# Altium project MINT_EEGAcquisitionSystem.PrjPcb
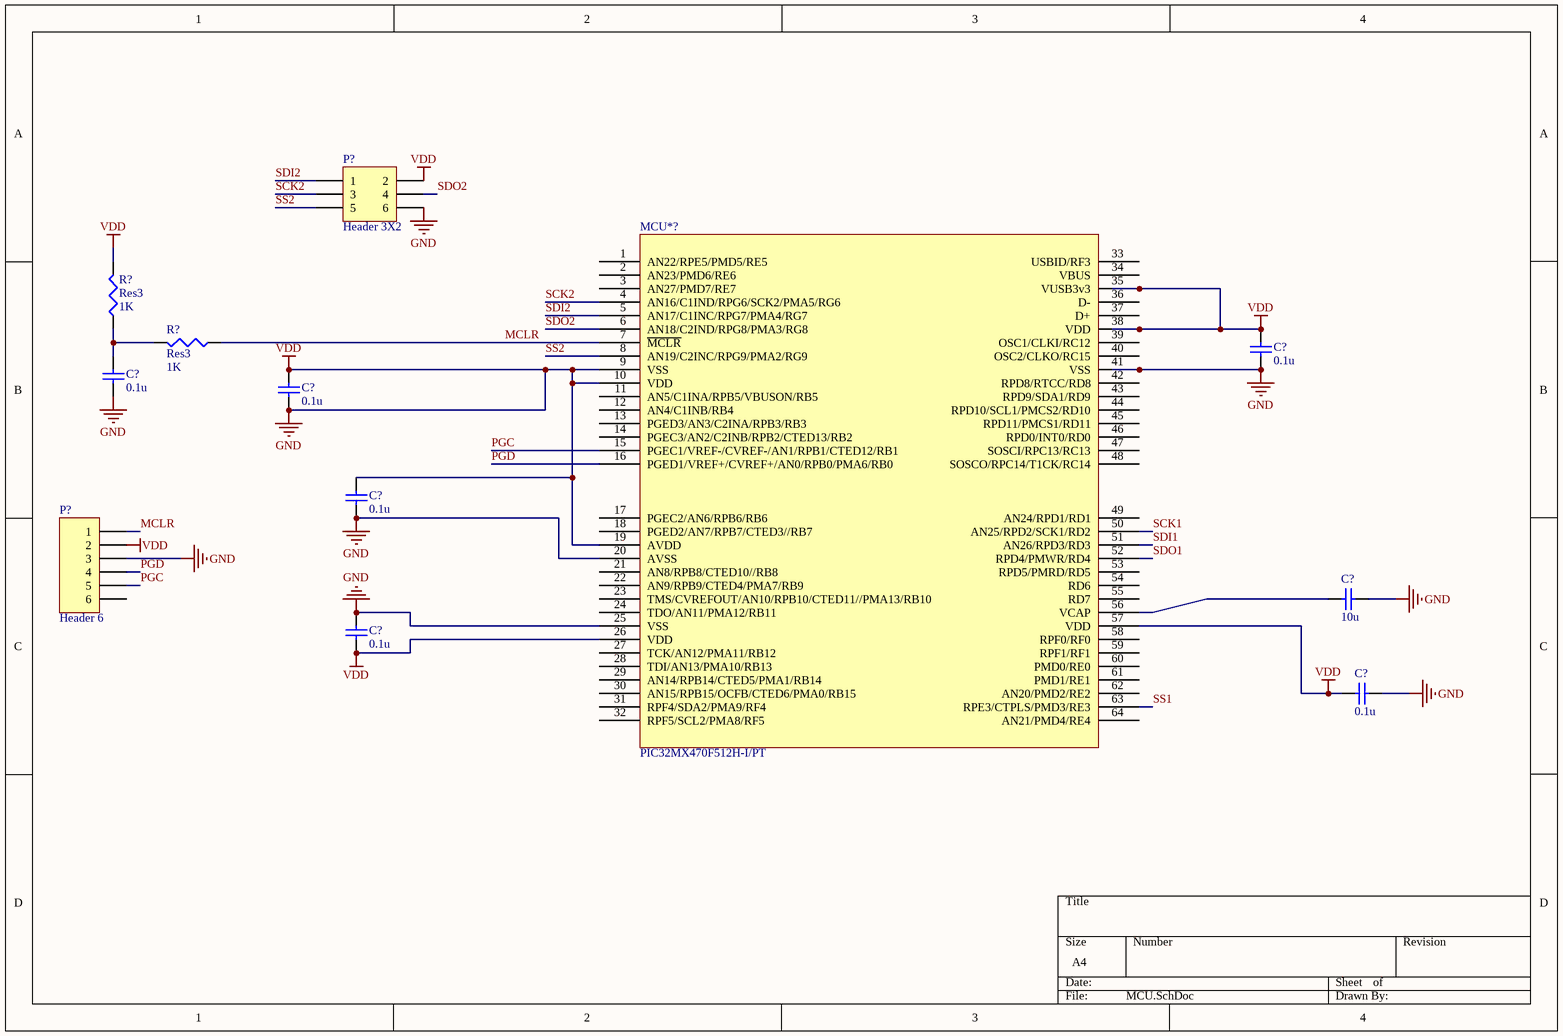
[diagram p0: MCU.SchDoc]
1 sheet, 12 parts. Net scope: global (net labels, ports and power ports of the same name join across sheets).

## Sheet MCU.SchDoc
size A4

### Parts
(Parts that share a designator on the sheet are numbered #1, #2 ... from top to bottom, then left to right.)
C?#1  0.1u  [0603]
C?#2  0.1u  [0603]
C?#3  0.1u  [0603]
C?#4  0.1u  [0603]
C?#5  10u  [0603]
C?#6  0.1u  [0603]
C?#7  0.1u  [0603]
MCU*?  PIC32MX470F512H-I/PT  [*QFP50P1200X1200X120-64N]
P?#1  Header 3X2  [HDR2X3]
P?#2  Header 6  [HDR1X6]
R?#1  Res3  value 1K  [J1-0603]
R?#2  Res3  value 1K  [J1-0603]

### Nets
GND: C?#1.1 C?#1.2 C?#2.2 C?#3.1 C?#3.2 C?#4.1 C?#4.2 C?#5.1 C?#6.1 C?#6.2 C?#7.1 C?#7.2 MCU*?.9(VSS) MCU*?.10(VDD) MCU*?.19(AVDD) MCU*?.20(AVSS) MCU*?.25(VSS) MCU*?.26(VDD) MCU*?.35(VUSB3v3) MCU*?.38(VDD) MCU*?.41(VSS) MCU*?.57(VDD) P?#1.2 P?#1.6 P?#2.2 P?#2.3 R?#1.2  [also labelled VDD]
MCLR: MCU*?.7(~{MCLR}) P?#2.1 R?#2.1
PGC: MCU*?.15(PGEC1/VREF-/CVREF-/AN1/RPB1/CTED12/RB1) P?#2.5
PGD: MCU*?.16(PGED1/VREF+/CVREF+/AN0/RPB0/PMA6/RB0) P?#2.4
SCK1: MCU*?.50(AN25/RPD2/SCK1/RD2)
SCK2: MCU*?.4(AN16/C1IND/RPG6/SCK2/PMA5/RG6) P?#1.3
SDI1: MCU*?.51(AN26/RPD3/RD3)
SDI2: MCU*?.5(AN17/C1INC/RPG7/PMA4/RG7) P?#1.1
SDO1: MCU*?.52(RPD4/PMWR/RD4)
SDO2: MCU*?.6(AN18/C2IND/RPG8/PMA3/RG8) P?#1.4
SS1: MCU*?.63(RPE3/CTPLS/PMD3/RE3)
SS2: MCU*?.8(AN19/C2INC/RPG9/PMA2/RG9) P?#1.5
NetC?#2_1: C?#2.1 R?#1.1 R?#2.2
NetC?#5_2: C?#5.2 MCU*?.56(VCAP)

Not connected (* = marked no-connect by the designer): MCU*? 1(AN22/RPE5/PMD5/RE5) 2(AN23/PMD6/RE6) 3(AN27/PMD7/RE7) 11(AN5/C1INA/RPB5/VBUSON/RB5) 12(AN4/C1INB/RB4) 13(PGED3/AN3/C2INA/RPB3/RB3) 14(PGEC3/AN2/C2INB/RPB2/CTED13/RB2) 17(PGEC2/AN6/RPB6/RB6) 18(PGED2/AN7/RPB7/CTED3//RB7) 21(AN8/RPB8/CTED10//RB8) 22(AN9/RPB9/CTED4/PMA7/RB9) 23(TMS/CVREFOUT/AN10/RPB10/CTED11//PMA13/RB10) 24(TDO/AN11/PMA12/RB11) 27(TCK/AN12/PMA11/RB12) 28(TDI/AN13/PMA10/RB13) 29(AN14/RPB14/CTED5/PMA1/RB14) 30(AN15/RPB15/OCFB/CTED6/PMA0/RB15) 31(RPF4/SDA2/PMA9/RF4) 32(RPF5/SCL2/PMA8/RF5) 33(USBID/RF3) 34(VBUS) 36(D-) 37(D+) 39(OSC1/CLKI/RC12) 40(OSC2/CLKO/RC15) 42(RPD8/RTCC/RD8) 43(RPD9/SDA1/RD9) 44(_RPD10/SCL1/PMCS2/RD10) 45(RPD11/PMCS1/RD11) 46(RPD0/INT0/RD0) 47(SOSCI/RPC13/RC13) 48(SOSCO/RPC14/T1CK/RC14) 49(_AN24/RPD1/RD1) 53(RPD5/PMRD/RD5) 54(RD6) 55(RD7) 58(_RPF0/RF0) 59(RPF1/RF1) 60(PMD0/RE0) 61(PMD1/RE1) 62(AN20/PMD2/RE2) 64(AN21/PMD4/RE4); P?#2 6

### Library data of the parts
C?#1-C?#7 = C0603: CER 10UF 25V X8R 1210; Supplier 1: Digi-Key; Supplier Part Number 1: 445-174833-1-ND
P?#1 = Header 3X2: Header, 3-Pin, Dual row; LatestRevisionDate: 17-Jul-2002; LatestRevisionNote: Re-released for DXP Platform.; Publisher: Altium Limited
P?#2 = Header 6: Header, 6-Pin; LatestRevisionDate: 17-Jul-2002; LatestRevisionNote: Re-released for DXP Platform.; Publisher: Altium Limited
R?#1 R?#2 = Res3: Resistor; Published: 8-Jun-2000; LatestRevisionDate: 29-May-2009; LatestRevisionNote: IPC-7351 Footprint Added.; PackageReference: J1-0603; Publisher: Altium Limited; PackageDescription: Chip Resistor